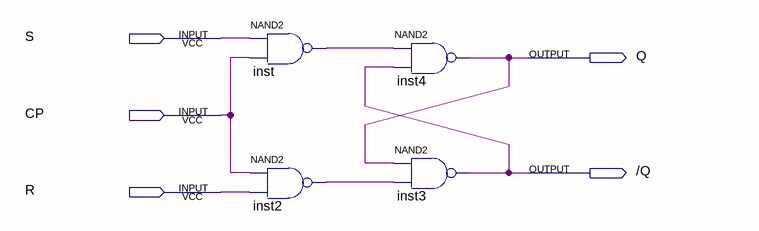
[diagram p0: schematic sheet]
// Quartus schematic SR_FlipFlop.bdf as structural Verilog: 4 symbols, 5 pins
module SR_FlipFlop (
  input  S,
  input  CP,
  input  R,
  output Q,
  output \/Q 
);

  wire inst2_out, inst_out;

  nand inst (inst_out, S, CP);
  nand inst2 (inst2_out, CP, R);
  nand inst4 (Q, inst_out, \/Q );
  nand inst3 (\/Q , Q, inst2_out);
endmodule
